# EAGLE design OpenBMS_Master_Shield (EAGLE 5.11)
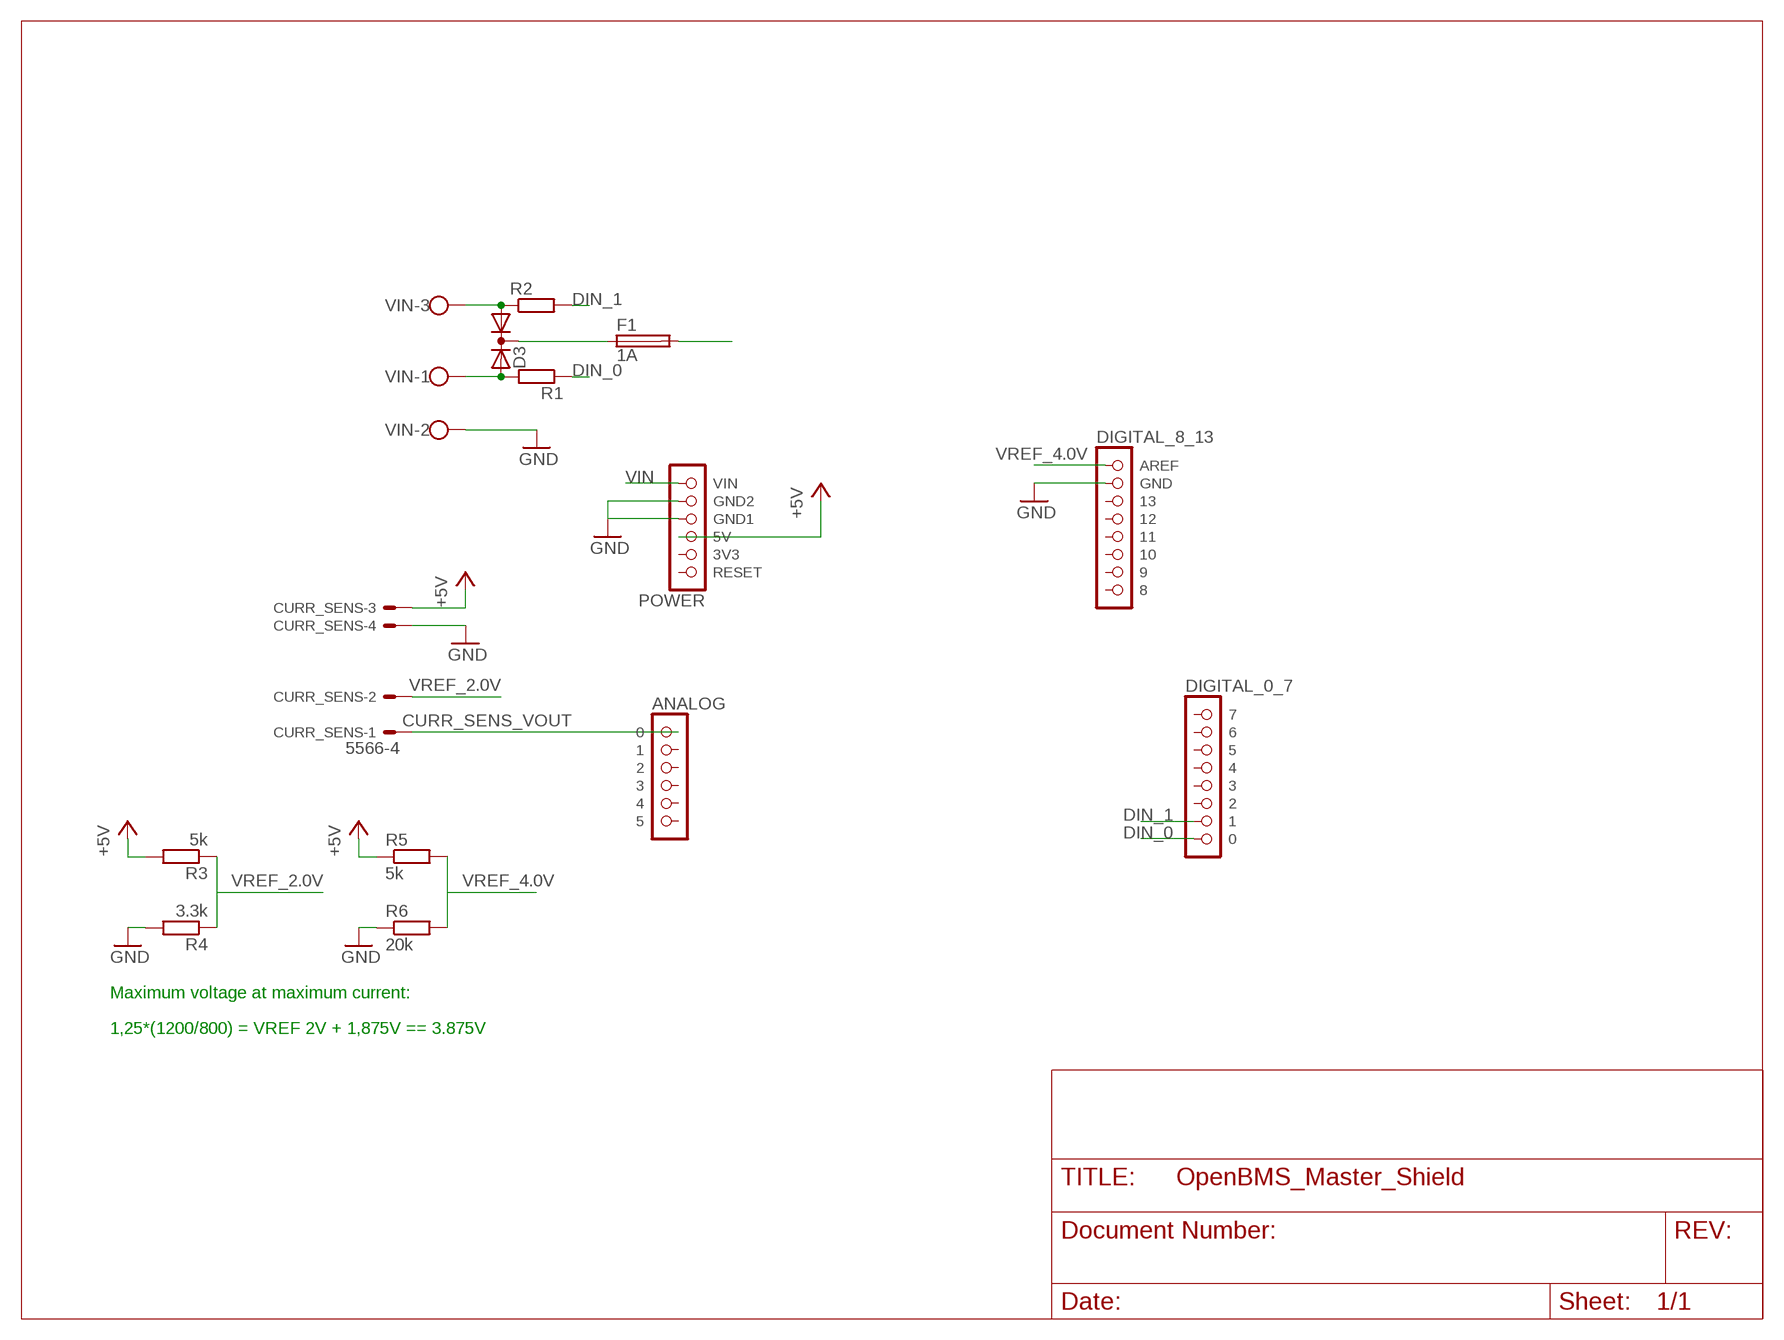
[diagram p0: schematic, sheet 1]

## Parts
CURR_SENS  5566-4  [5566-4]
D3  DIODE_AC-CA_  [SOT23C]
F1  1A  FUSEBLANK_5X20MM  [FUSE_HOLDER_5X20MM]
R1  R-EU_R1206  [R1206]
R2  R-EU_R1206  [R1206]
R3  5k  R-EU_R1206  [R1206]
R4  3.3k  R-EU_R1206  [R1206]
R5  5k  R-EU_R1206  [R1206]
R6  20k  R-EU_R1206  [R1206]
U$1  POWER  [1X06]
U$2  ANALOG  [1X06]
U$3  DIGITAL_0_7  [1X08]
U$4  DIGITAL_8_13  [1X08]
VIN  W237-103  [W237-103]

## Nets
+5V: CURR_SENS.3 R3.2 R5.1 U$1.3(5V)
CURR_SENS_VOUT: CURR_SENS.1 U$2.1
DIN_0: R1.1 U$3.8
DIN_1: R2.2 U$3.7
GND: CURR_SENS.4 R4.2 R6.1 U$1.4(GND1) U$1.5(GND2) U$4.2(GND) VIN.2
N$1: D3.2(A2) R1.2 VIN.1
N$2: D3.1(A1) R2.1 VIN.3
N$3: D3.3(K) F1.1
VIN: F1.2 U$1.6(VIN)
VREF_2.0V: CURR_SENS.2 R3.1 R4.1
VREF_4.0V: R5.2 R6.2 U$4.1(AREF)
Unconnected: U$1.1(RESET) U$1.2(3V3) U$2.2 U$2.3 U$2.4 U$2.5 U$2.6 U$3.1 U$3.2 U$3.3 U$3.4 U$3.5 U$3.6 U$4.3 U$4.4 U$4.5 U$4.6 U$4.7 U$4.8

## Notes on the sheet
- Maximum voltage at maximum current:
- 1,25*(1200/800) = VREF 2V + 1,875V == 3.875V

## Library data of the parts
CURR_SENS = con-molex:5566-4: Mini FIT connector 4 pol Source: http://www.molex.com; OC_FARNELL: unknown; OC_NEWARK: unknown
D3 = semicon-smd-ipc:DIODE_AC-CA_: DUAL DIODE
F1 = fuse:FUSE: Fuse; OC_FARNELL: unknown; OC_NEWARK: unknown
R1-R6 = resistor:R-EU_: RESISTOR, European symbol
U$1 = arduino:POWER
U$2 = arduino:ANALOG
U$3 = arduino:DIGITAL_0_7
U$4 = arduino:DIGITAL_8_13
VIN = con-wago-500:W237-103: WAGO SCREW CLAMP; MPN: 237-103; OC_FARNELL: unknown; OC_NEWARK: 18M7116

## Board
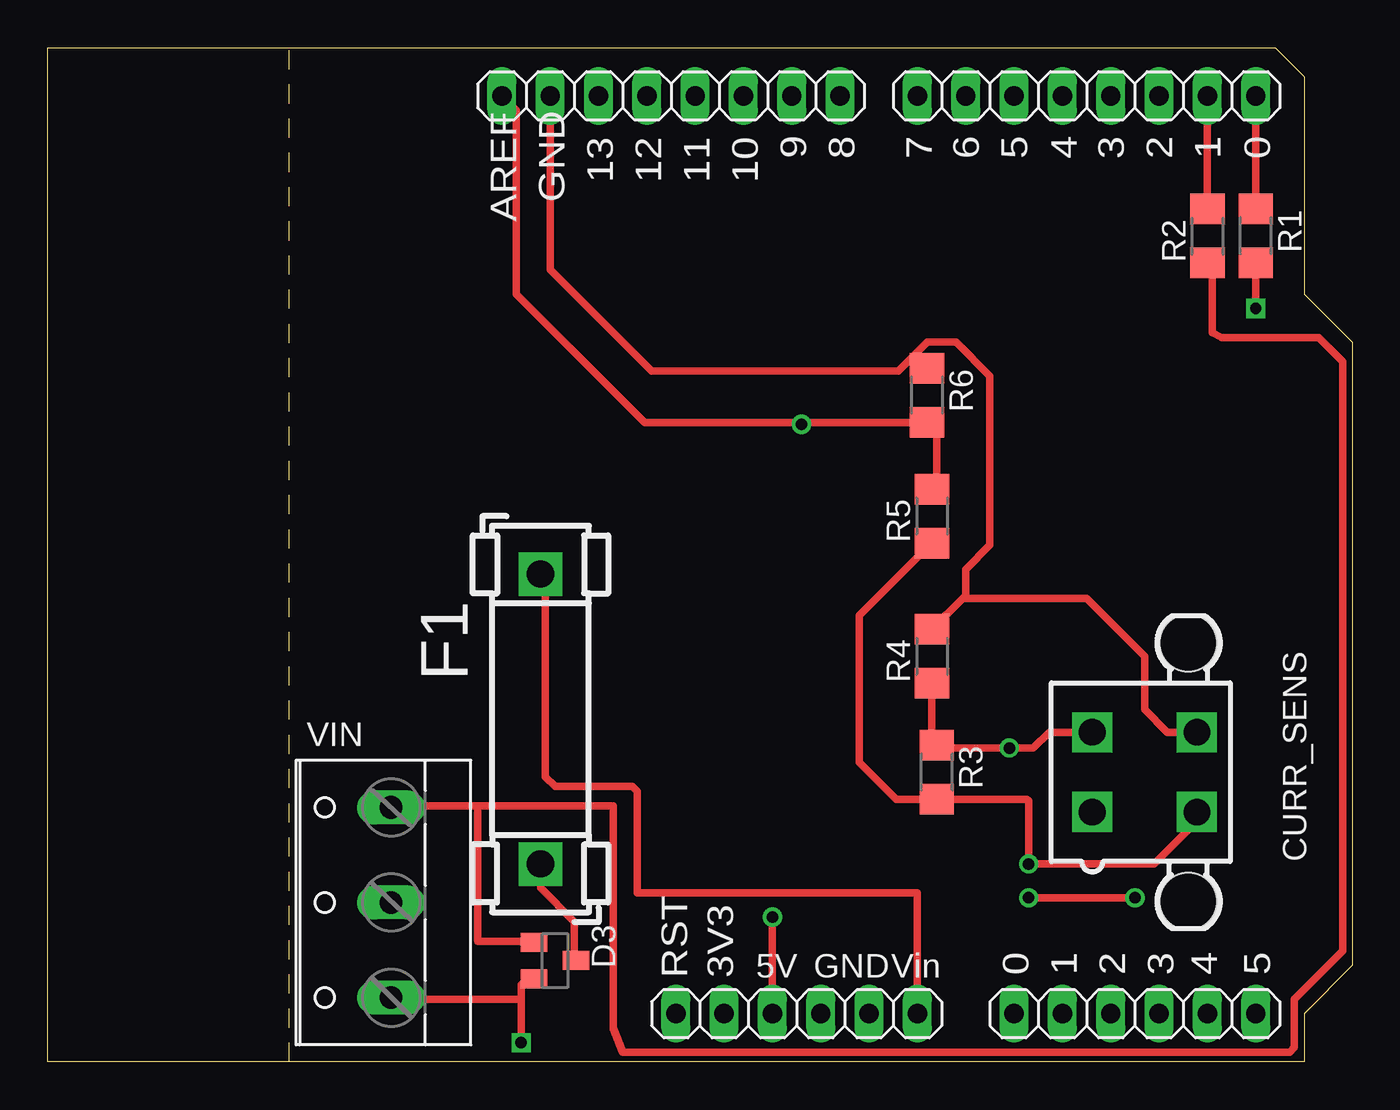
[diagram p1: board, top side]
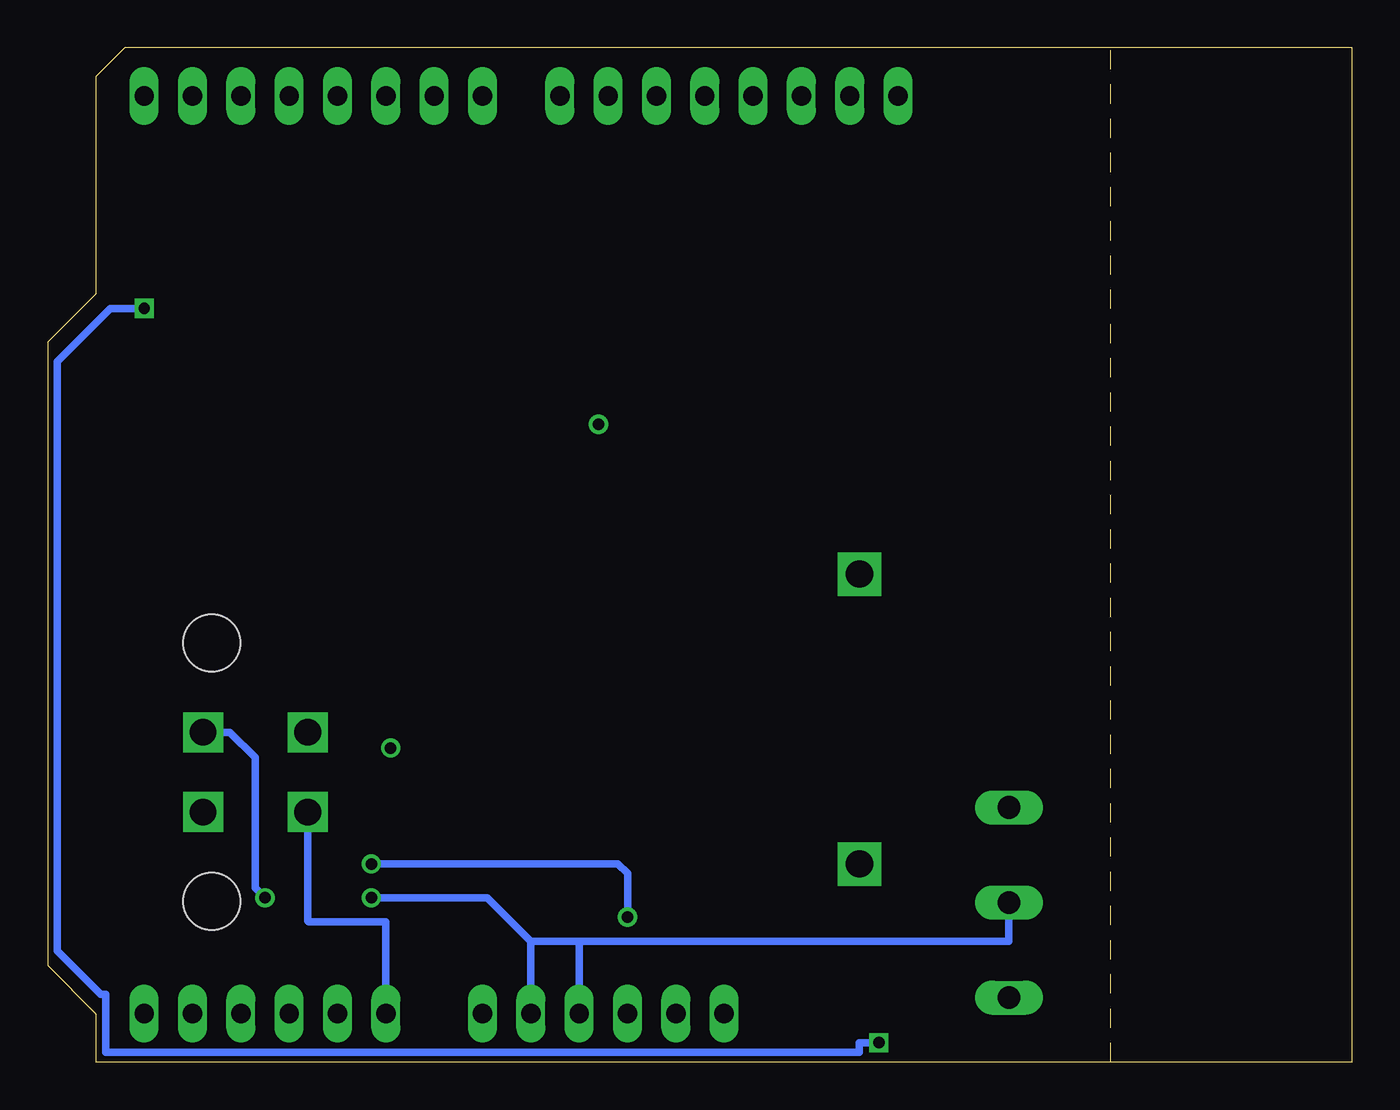
[diagram p2: board, bottom side, seen from below]

Size 68.58 x 53.34 mm. Coordinates in mm from the lower left corner, seen from the top.
Outline: 12.7,53.34 0,53.34 0,0 12.7,0
Outline: 12.7,53.34 64.52,53.34 66.04,51.82 66.04,40.39 68.58,37.85 68.58,5.08 66.04,2.54 66.04,0 12.7,0
Outline: 12.7,0 12.7,53.34
Copper layers (1*16): Top 0.035mm / dielectric 1.5mm / Bottom 0.035mm
Design rules "default": minimum track width 10mil, minimum drill 24mil, track to track 8mil, track to pad 8mil, pad to pad 8mil, via to via 8mil, smd to smd 8mil, copper to edge 40mil, drill to drill 8mil, minimum pad ring 10mil, minimum via ring 8mil, stop-mask expansion 4mil, vias tented up to drill 0mil, thermal gap 10mil

### Footprints (pad centres in the part's own frame; a part is rotated, then mirrored left to right if it is on the bottom)
5566-4 = drill 1.4 square: 1 2.1,-2.75; 2 -2.1,-2.75; 3 2.1,2.75; 4 -2.1,2.75 | hole 3: 6.8,2.29; -6.8,2.29
SOT23C = smd 1 x 1.4: 1 -0.95,-1.1; 2 0.95,-1.1; 3 0,1.1
FUSE_HOLDER_5X20MM = drill 1.422 pad 2.286 square: 1 0,0; 2 15.24,0
R1206 = smd 1.6 x 1.803: 1 -1.422,0; 2 1.422,0
1X06 = drill 1.016 long: 1 -6.35,0; 2 -3.81,0; 3 -1.27,0; 4 1.27,0; 5 3.81,0; 6 6.35,0
1X08 = drill 1.016 long: 1 -8.89,0; 2 -6.35,0; 3 -3.81,0; 4 -1.27,0; 5 1.27,0; 6 3.81,0; 7 6.35,0; 8 8.89,0
W237-103 = drill 1.194 long: 1 -5,-1.29; 2 0,-1.29; 3 5,-1.29

### Placement (x,y rotation side)
CURR_SENS  57.66,15.24 270 top
D3  26.67,5.33 270 top
F1  25.91,10.41 90 top
R1  63.5,43.43 270 top
R2  60.96,43.43 90 top
R3  46.74,15.24 270 top
R4  46.48,21.34 90 top
R5  46.48,28.7 90 top
R6  46.23,35.05 270 top
U$1  39.37,2.54 0 top
U$2  57.15,2.54 0 top
U$3  54.61,50.8 0 top
U$4  32.77,50.8 0 top
VIN  16.76,8.38 90 top

### Tracks (layer width: path | path; a pad name or v marks a point on that pad's centre or on a via)
+5V  (via drill 0.6)
  Top 0.406: U$1.3 v38.1,7.62 | CURR_SENS.3 60.41,12.66 58.17,10.41 v51.56,10.41 51.56,13.72 51.46,13.82 R3.2 44.6,13.82 42.67,15.75 42.67,23.47 R5.1
  Bottom 0.406: v38.1,7.62 38.1,9.91 38.61,10.41 v51.56,10.41
CURR_SENS_VOUT
  Bottom 0.406: U$2.1 50.8,7.37 54.86,7.37 54.91,7.41 CURR_SENS.1
DIN_0
  Top 0.406: R1.1 U$3.8
DIN_1
  Top 0.406: R2.2 U$3.7
GND  (via drill 0.6)
  Top 0.406: v51.56,8.64 v57.15,8.64 | 48.11,24.38 R4.2 | 48.11,24.38 54.61,24.38 57.66,21.34 57.66,18.54 58.86,17.34 CURR_SENS.4 | 48.11,24.38 48.26,24.54 48.26,25.91 49.53,27.18 49.53,36.07 47.75,37.85 46.23,37.85 45.72,37.34 | 45.72,37.34 45.72,36.58 45.82,36.47 R6.1 | 45.72,37.34 44.7,36.32 31.75,36.32 26.42,41.66 U$4.2
  Bottom 0.406: VIN.2 18.05,6.35 40.64,6.35 | 40.64,6.35 U$1.4 | 43.18,6.35 U$1.5 | 40.64,6.35 43.18,6.35 | 43.18,6.35 45.47,8.64 v51.56,8.64 | v57.15,8.64 57.66,9.14 57.66,16 59,17.34 CURR_SENS.4
N$1  (via drill 0.6)
  Top 0.406: v63.5,39.62 R1.2 | 24.89,3.3 v24.89,1.02 | 24.89,3.3 24.89,4.06 25.21,4.38 D3.2 | VIN.1 18.13,3.3 24.89,3.3
  Bottom 0.406: v63.5,39.62 65.28,39.62 68.07,36.83 68.07,5.84 65.79,3.56 65.53,3.56 65.53,0.51 25.91,0.51 25.91,1.02 v24.89,1.02
N$2
  Top 0.406: R2.1 61.21,41.76 61.21,38.35 61.72,38.1 66.8,38.1 68.07,36.83 68.07,5.84 65.53,3.3 65.53,0.76 65.28,0.51 30.23,0.51 29.72,1.78 29.72,13.46 22.61,13.46 | 22.61,13.46 22.61,6.35 24.89,6.35 24.96,6.28 D3.1 | VIN.3 18.13,13.46 22.61,13.46
N$3
  Top 0.406: D3.3 27.69,5.42 27.69,7.37 25.91,9.14 F1.1
N$4  (via drill 0.6)
  other vias: 39.62,33.53
VIN
  Top 0.406: F1.2 26.16,25.4 26.16,14.99 26.67,14.48 30.73,14.48 30.99,14.22 30.99,8.89 45.72,8.89 U$1.6
VREF_2.0V  (via drill 0.6)
  Top 0.406: R4.1 46.48,16.92 R3.1 46.89,16.51 v50.55,16.51 51.82,16.51 52.65,17.34 CURR_SENS.2
VREF_4.0V
  Top 0.406: R5.2 46.74,30.38 46.74,33.27 46.38,33.63 R6.2 31.39,33.63 24.64,40.39 24.64,50.04 U$4.1

### Text on the board
tNames: 9 | 8 | 7 | 6 | 5 | 4 | 3 | 2 | 1 | 0 | 13 | 12 | 11 | 10 | GND | AREF | 0 | 1 | 2 | 3 | 4 | 5 | RST | 3V3 | 5V | GND | Vin
Document: TP2 4V | TP1 2V | +12V
TallParts: USB | ISP | PWR
ArduinoHoles: 3.2mm | 2.2mm | 3.2mm